# Altium schematic sheet [06] - PERIPHERAL.SchDoc
size A3; CompanyName: FPT-FTI copporation; Address1: FPT Building Duy Tan; Address2: Floor 4,; DocumentNumber: 6; SheetNumber: 6; SheetTotal: 8; NameAuthor: Angle Vu
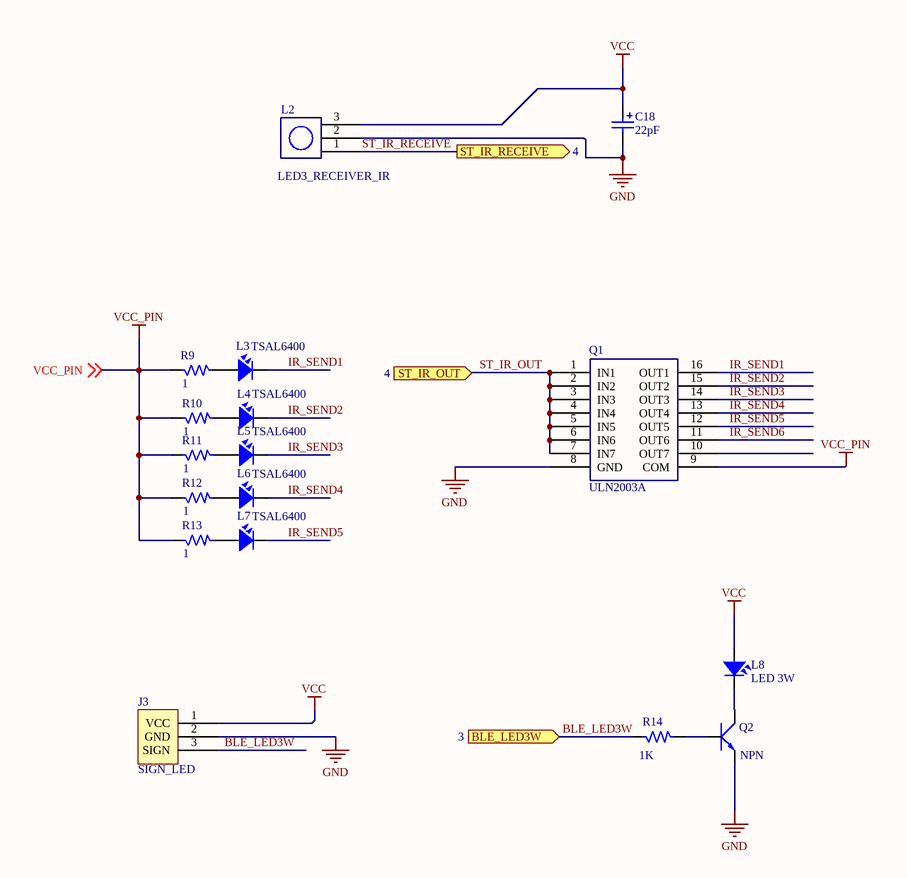
[diagram p0: [06] - PERIPHERAL.SchDoc]

## Parts
C18  Capacitance: 22pF  [CAP_SMD0603]  (hidden comment: C_22pF_SMD0603_CERAMIC_50V)
J3  SIGN_LED  [HEADER3_SIGN_LED]
L2  LED3_RECEIVER_IR  [LED3_IR_RECEIVER]
L3  TSAL6400  [LED2_IR_TRANSMITOR]
L4  TSAL6400  [LED2_IR_TRANSMITOR]
L5  TSAL6400  [LED2_IR_TRANSMITOR]
L6  TSAL6400  [LED2_IR_TRANSMITOR]
L7  TSAL6400  [LED2_IR_TRANSMITOR]
L8  LED 3W  [LED2_IR_TRANSMITOR]
Q1  ULN2003A  [TRAN7_ULN2003_16SOIC]
Q2  NPN  [TRAN-NPN-SMD]
R9  Resistance (Ohms): 1  [RES_SMD0603]  (hidden comment: R_1OhM_SMD0603_1%_1/4W)
R10  Resistance (Ohms): 1  [RES_SMD0603]  (hidden comment: R_1OhM_SMD0603_1%_1/4W)
R11  Resistance (Ohms): 1  [RES_SMD0603]  (hidden comment: R_1OhM_SMD0603_1%_1/4W)
R12  Resistance (Ohms): 1  [RES_SMD0603]  (hidden comment: R_1OhM_SMD0603_1%_1/4W)
R13  Resistance (Ohms): 1  [RES_SMD0603]  (hidden comment: R_1OhM_SMD0603_1%_1/4W)
R14  Resistance (Ohms): 1K  [RES_SMD0603]  (hidden comment: R_1K_SMD0603_1%_1/10W)

## Ports
BLE_LED3W (in, see 3), ST_IR_OUT (in, see 4), ST_IR_RECEIVE (out, see 4)

## Nets
GND: C18.2 J3.2(GND) L2.2(GND) Q1.8(GND) Q2.2(E)
VCC: C18.1 J3.1(VCC) L2.3(VCC) L8.1
VCC_PIN: Q1.9(COM) R9.1 R10.1 R11.1 R12.1 R13.1 ; off-sheet VCC_PIN
BLE_LED3W: J3.3(SIGN) R14.1 ; port BLE_LED3W
IR_SEND1: L3.2 Q1.16(OUT1)
IR_SEND2: L4.2 Q1.15(OUT2)
IR_SEND3: L5.2 Q1.14(OUT3)
IR_SEND4: L6.2 Q1.13(OUT4)
IR_SEND5: L7.2 Q1.12(OUT5)
IR_SEND6: Q1.11(OUT6)
ST_IR_OUT: Q1.1(IN1) Q1.2(IN2) Q1.3(IN3) Q1.4(IN4) Q1.5(IN5) Q1.6(IN6) Q1.7(IN7) ; port ST_IR_OUT
ST_IR_RECEIVE: L2.1(OUT) ; port ST_IR_RECEIVE
NetL3_1: L3.1 R9.2
NetL4_1: L4.1 R10.2
NetL5_1: L5.1 R11.2
NetL6_1: L6.1 R12.2
NetL7_1: L7.1 R13.2
NetL8_2: L8.2 Q2.3(C)
NetQ2_1: Q2.1(B) R14.2

Not connected (* = marked no-connect by the designer): Q1 10(OUT7)

## Notes on the sheet
- Designed By
- Checked By
- Company:
- Size:
- A3
- Address:
- Sheet:
- /

## Library data of the parts
C18 = C_22pF_SMD0603_CERAMIC_50V: CAP CER 22PF 50V NP0 0603; Manufacturer: Murata Electronics North America; Manufacturer Part Number: GQM1885C1H220JB01D; Tolerance: ±5%; Temperature Coefficient: C0G, NP0; Supplier 1: Digi-Key; RoHS: RoHS Compliant; Category: Capacitors; Stock 1: 40000; Pricing 1: 4000=0.168, 8000=0.1568, 12000=0.154, 28000=0.1512, 100000=0.14 (USD); Packaging: Tape & Reel (TR); Part Status: Active; Voltage - Rated: 50V; Mounting Type: Surface Mount, MLCC; Operating Temperature: -55°C ~ 125°C; Applications: RF, Microwave, High Frequency; Ratings: -; Package / Case: 0603 (1608 Metric); Size / Dimension: 0.063" L x 0.031" W (1.60mm x 0.80mm); Height - Seated (Max): -; Thickness (Max): 0.035" (0.90mm); Lead Spacing: -; Features: High Q, Low Loss; Lead Style: -; ComponentLink1URL: http://www.murata.com/~/media/webrenewal/support/library/catalog/products/capacitor/mlcc/c02e.pdf; ComponentLink1Description: http://www.murata.com/~/media/webrenewal/support/library/catalog/products/capacitor/mlcc/c02e.pdf; Supplier Part Number 1: 490-3575-2-ND
J3 = HEADER3_SIGN_LED_HOLE2.54: CONN HEADER VERT 3POS .100 TIN; Manufacturer: TE Connectivity AMP Connectors; Manufacturer Part Number: 640456-3; Connector Type: Header, Unshrouded; Number of Positions: 3; Number of Positions Loaded: All; Pitch: 0.100" (2.54mm); Supplier 1: Digi-Key; RoHS: RoHS Compliant; Category: Connectors, Interconnects; Stock 1: 100299; Pricing 1: 1=0.13, 10=0.119, 100=0.095, 500=0.088, 1000=0.081, 2000=0.075, 5000=0.07, 10000=0.056, 25000=0.052 (USD); Packaging: Bulk; Part Status: Active; Contact Type: Male Pin; Number of Rows: 1; Row Spacing: -; Contact Mating Length: 0.295" (7.49mm); Mounting Type: Through Hole; Termination: Solder; Fastening Type: Friction Lock; Features: -; Contact Finish: Tin; Contact Finish Thickness: -; Color: Natural; ComponentLink1URL: http://www.te.com/commerce/DocumentDelivery/DDEController?Action=srchrtrv&DocNm=640456&DocType=Customer+Drawing&DocLang=English; ComponentLink1Description: http://www.te.com/commerce/DocumentDelivery/DDEController?Action=srchrtrv&DocNm=640456&DocType=Customer+Drawing&DocLang=English; Supplier Part Number 1: A19470-ND
L2 = LED3_RECEIVER_IR_HOLE_38KHz_3V: RECEIVER IR REM CTRL 3V 38KHZ; Manufacturer: Sharp Microelectronics; Manufacturer Part Number: GP1UE261XKVF; Sensing Distance: 10m; B.P.F. Center Frequency: 38.0kHz; Voltage - Supply: 2.7 V ~ 5.5 V; Current - Supply: 400µA; Supplier 1: Digi-Key; RoHS: RoHS Compliant; Category: Sensors, Transducers; Stock 1: 4398; Pricing 1: 1=1.3, 10=1.053, 25=0.81, 100=0.729, 250=0.648, 500=0.5508, 1000=0.4536, 2500=0.432 (USD); Part Status: Active; Orientation: Top View; Mounting Type: Through Hole; Operating Temperature: -10°C ~ 70°C (TA); ComponentLink1URL: http://www.sharpsma.com/ru/download/GP1UE26XK0VF-Epdf; ComponentLink1Description: http://www.sharpsma.com/ru/download/GP1UE26XK0VF-Epdf; Supplier Part Number 1: 425-2883-ND
L3-L8 = LED2_TRANSMITER_IR_TSAL6400_HOLE_5MM: EMITTER IR 940NM 100MA RADIAL; Manufacturer: Vishay Semiconductor Opto Division; Type: Infrared (IR); Radiant Intensity (Ie) Min @ If: 25mW/sr @ 100mA; Voltage - Forward (Vf) (Typ): 1.35V; Viewing Angle: 50°; Supplier 1: Digi-Key; Manufacturer Part Number: TSAL6400; RoHS: RoHS Compliant; Category: Optoelectronics; Stock 1: 12590; Pricing 1: 1=0.57, 10=0.412, 25=0.336, 100=0.2688, 250=0.2268, 500=0.1932, 1000=0.1512, 2500=0.1386, 5000=0.126 (USD); Packaging: Bulk; Part Status: Active; Current - DC Forward (If) (Max): 100mA; Wavelength: 940nm; Orientation: Top View; Operating Temperature: -40°C ~ 85°C (TA); Mounting Type: Through Hole; Package / Case: Radial, 5mm Dia (T 1 3/4); ComponentLink1URL: http://www.vishay.com/docs/81011/tsal6400.pdf; ComponentLink1Description: http://www.vishay.com/docs/81011/tsal6400.pdf; Supplier Part Number 1: 751-1205-ND
Q1 = TRAN_7NPN_SMD_16SOIC: TRANS 7NPN DARL 50V 0.5A 16SO; Manufacturer: Texas Instruments; Manufacturer Part Number: ULN2003ADR; Transistor Type: 7 NPN Darlington; Current - Collector (Ic) (Max): 500mA; Vce Saturation (Max) @ Ib, Ic: 1.6V @ 500µA, 350mA; Supplier 1: Digi-Key; RoHS: RoHS Compliant; Category: Discrete Semiconductor Products; Stock 1: 35000; Pricing 1: 2500=0.186, 5000=0.174, 12500=0.162, 25000=0.1536, 62500=0.15 (USD); Packaging: Tape & Reel (TR); Part Status: Active; Voltage - Collector Emitter Breakdown (Max): 50V; Current - Collector Cutoff (Max): -; DC Current Gain (hFE) (Min) @ Ic, Vce: -; Power - Max: -; Frequency - Transition: -; Mounting Type: Surface Mount; Package / Case: 16-SOIC (0.154", 3.90mm Width); Supplier Device Package: 16-SOIC; ComponentLink1URL: http://www.ti.com/lit/ds/symlink/uln2003a.pdf; ComponentLink1Description: http://www.ti.com/lit/ds/symlink/uln2003a.pdf; Supplier Part Number 1: 296-1368-2-ND
Q2 = TRAN_NPN_SMD_SOT23_0.2A_40V: TRANS NPN 40V 0.2A SOT23; Manufacturer: ON Semiconductor; Manufacturer Part Number: MMBT3904LT1G; Current - Collector (Ic) (Max): 200mA; Vce Saturation (Max) @ Ib, Ic: 300mV @ 5mA, 50mA; DC Current Gain (hFE) (Min) @ Ic, Vce: 100 @ 10mA, 1V; Power - Max: 300mW; Frequency - Transition: 300MHz; Supplier 1: Digi-Key; RoHS: RoHS Compliant; Category: Discrete Semiconductor Products; Stock 1: 540000; Pricing 1: 3000=0.01913, 6000=0.01725, 15000=0.015, 30000=0.0135, 75000=0.012, 150000=0.00998 (USD); Packaging: Tape & Reel (TR); Part Status: Active; Transistor Type: NPN; Voltage - Collector Emitter Breakdown (Max): 40V; Current - Collector Cutoff (Max): -; Mounting Type: Surface Mount; Package / Case: TO-236-3, SC-59, SOT-23-3; Supplier Device Package: SOT-23-3 (TO-236); ComponentLink1URL: http://www.onsemi.com/pub_link/Collateral/MMBT3904LT1-D.PDF; ComponentLink1Description: http://www.onsemi.com/pub_link/Collateral/MMBT3904LT1-D.PDF; Supplier Part Number 1: MMBT3904LT1GOSTR-ND
R9-R13 = R_1OhM_SMD0603_1%_1/4W: RES SMD 1 OHM 1% 1/4W 0603; Manufacturer: Panasonic Electronic Components; Manufacturer Part Number: ERJ-3BQF1R0V; Power (Watts): 0.25W, 1/4W; Temperature Coefficient: ±200ppm/°C; Supplier 1: Digi-Key; RoHS: RoHS Compliant; Category: Resistors; Stock 1: 5000; Pricing 1: 5000=0.0408, 10000=0.03808, 25000=0.03618, 50000=0.03544, 125000=0.03468 (USD); Packaging: Tape & Reel (TR); Part Status: Active; Tolerance: ±1%; Composition: Thick Film; Features: Automotive AEC-Q200, Current Sense; Operating Temperature: -55°C ~ 125°C; Package / Case: 0603 (1608 Metric); Supplier Device Package: 0603; Size / Dimension: 0.063" L x 0.031" W (1.60mm x 0.80mm); Height: 0.022" (0.55mm); Number of Terminations: 2; ComponentLink1URL: https://industrial.panasonic.com/cdbs/www-data/pdf/RDA0000/AOA0000C239.pdf; ComponentLink1Description: https://industrial.panasonic.com/cdbs/www-data/pdf/RDA0000/AOA0000C239.pdf; Supplier Part Number 1: P17371TR-ND
R14 = R_1K_SMD0603_1%_1/10W: RES SMD 1K OHM 1% 1/10W 0603; Manufacturer: Yageo; Manufacturer Part Number: RC0603FR-071KL; Power (Watts): 0.1W, 1/10W; Temperature Coefficient: ±100ppm/°C; Supplier 1: Digi-Key; RoHS: RoHS Compliant; Category: Resistors; Stock 1: 6725000; Pricing 1: 5000=0.00167, 10000=0.00145, 25000=0.00128, 50000=0.00117, 125000=0.00115 (USD); Packaging: Tape & Reel (TR); Part Status: Active; Tolerance: ±1%; Composition: Thick Film; Features: Moisture Resistant; Operating Temperature: -55°C ~ 155°C; Package / Case: 0603 (1608 Metric); Supplier Device Package: 0603; Size / Dimension: 0.063" L x 0.031" W (1.60mm x 0.80mm); Height: 0.022" (0.55mm); Number of Terminations: 2; ComponentLink1URL: http://www.yageo.com/documents/recent/PYu-RC_Group_51_RoHS_L_04.pdf; ComponentLink1Description: http://www.yageo.com/documents/recent/PYu-RC_Group_51_RoHS_L_04.pdf; Supplier Part Number 1: 311-1.00KHRTR-ND